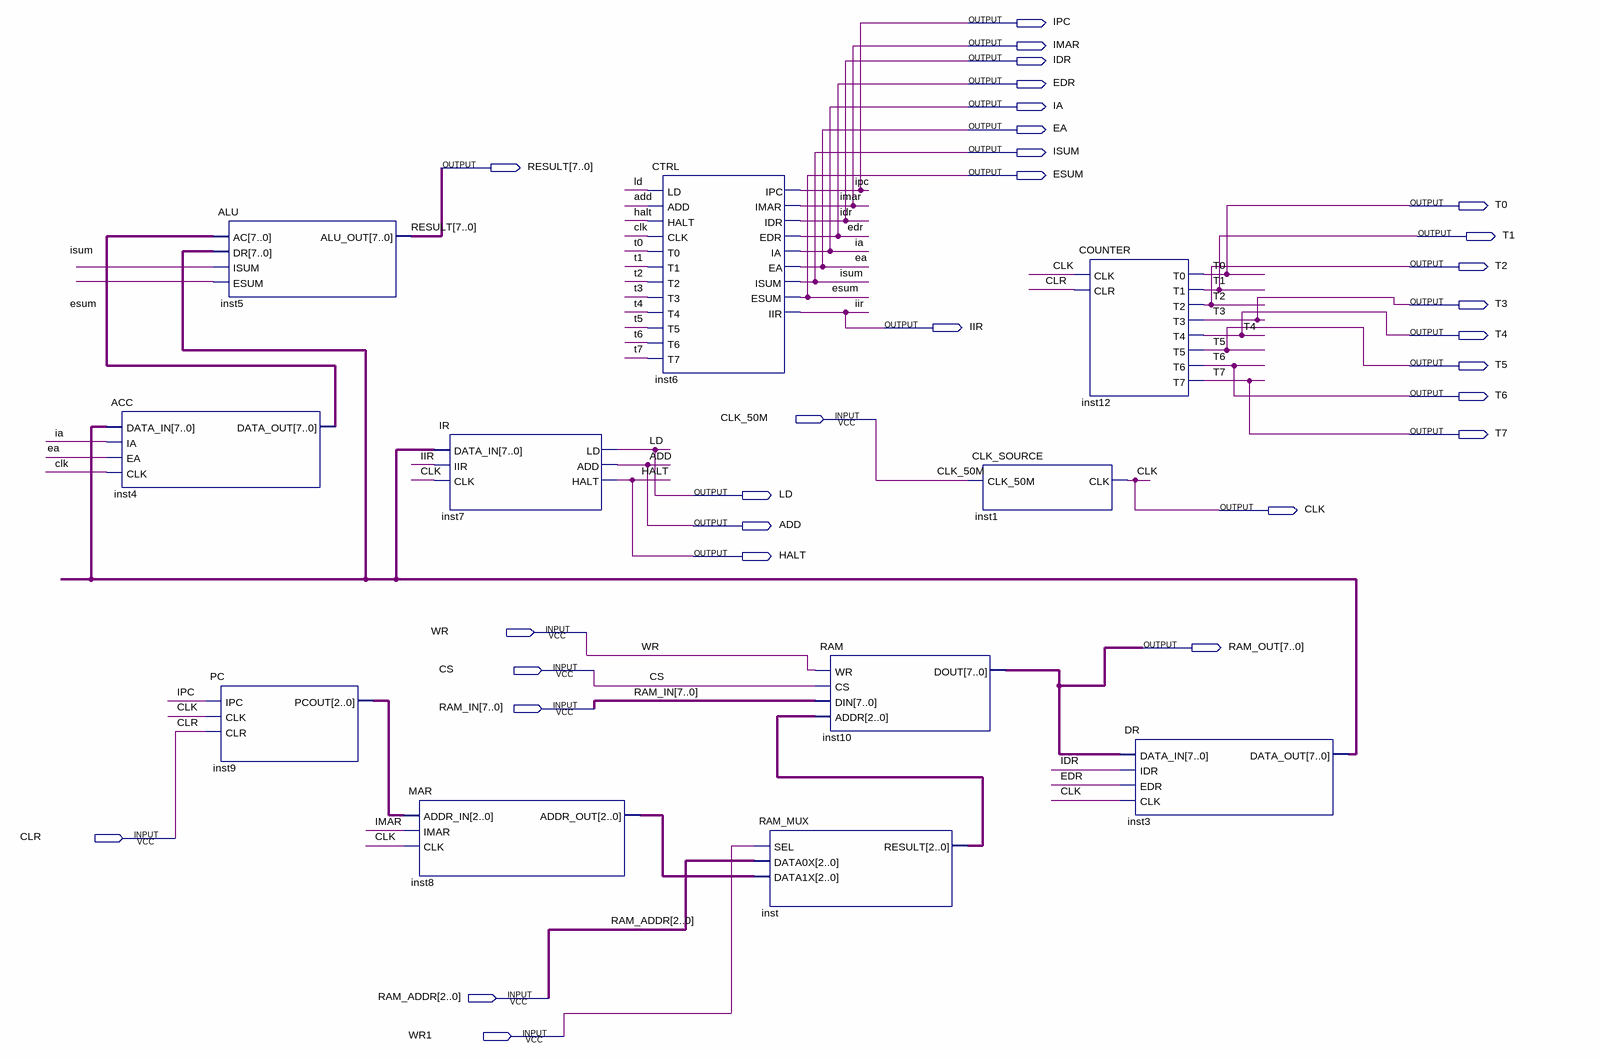
[diagram p0: schematic sheet]
// Quartus schematic MC_TEMP.bdf as structural Verilog: 11 symbols, 30 pins
module MC_TEMP (
  input  CLK_50M,
  input  WR,
  input  CS,
  input  [7:0] RAM_IN,
  input  CLR,
  input  [2:0] RAM_ADDR,
  input  WR1,
  output IPC,
  output IMAR,
  output IDR,
  output EDR,
  output IA,
  output EA,
  output ISUM,
  output [7:0] RESULT,
  output ESUM,
  output T0,
  output T1,
  output T2,
  output T3,
  output IIR,
  output T4,
  output T5,
  output T6,
  output T7,
  output LD,
  output CLK,
  output ADD,
  output HALT,
  output [7:0] RAM_OUT
);

  wire [2:0] inst8_addr_out, inst9_pcout, inst_result;
  wire [7:0] inst3_data_out, inst4_data_out;

  ACC inst4 (.DATA_IN(inst3_data_out), .IA(IA), .EA(EA), .CLK(CLK), .DATA_OUT(inst4_data_out));
  ALU inst5 (.AC(inst4_data_out), .DR(inst3_data_out), .ISUM(ISUM), .ESUM(ESUM), .ALU_OUT(RESULT));
  PC inst9 (.IPC(IPC), .CLK(CLK), .CLR(CLR), .PCOUT(inst9_pcout));
  IR inst7 (.DATA_IN(inst3_data_out), .IIR(IIR), .CLK(CLK), .LD(LD), .ADD(ADD), .HALT(HALT));
  MAR inst8 (.ADDR_IN(inst9_pcout), .IMAR(IMAR), .CLK(CLK), .ADDR_OUT(inst8_addr_out));
  CTRL inst6 (
    .LD(LD), .ADD(ADD), .HALT(HALT), .CLK(CLK), .T0(T0), .T1(T1), .T2(T2), .T3(T3), .T4(T4), .T5(T5),
    .T6(T6), .T7(T7), .IPC(IPC), .IMAR(IMAR), .IDR(IDR), .EDR(EDR), .IA(IA), .EA(EA), .ISUM(ISUM),
    .ESUM(ESUM), .IIR(IIR));
  RAM_MUX inst (.SEL(WR1), .DATA0X(RAM_ADDR), .DATA1X(inst8_addr_out), .RESULT(inst_result));
  RAM inst10 (.WR(WR), .CS(CS), .DIN(RAM_IN), .ADDR(inst_result), .DOUT(RAM_OUT));
  CLK_SOURCE inst1 (.CLK_50M(CLK_50M), .CLK(CLK));
  COUNTER inst12 (.CLK(CLK), .CLR(CLR), .T0(T0), .T1(T1), .T2(T2), .T3(T3), .T4(T4), .T5(T5), .T6(T6), .T7(T7));
  DR inst3 (.DATA_IN(RAM_OUT), .IDR(IDR), .EDR(EDR), .CLK(CLK), .DATA_OUT(inst3_data_out));
endmodule
